# Altium schematic sheet EXTERNAL-INTERFACES.SchDoc: External Interfaces
size A3; Author: João Guimarães; Revision: 1.0.0; SheetNumber: 7; SheetTotal: 7; Project: Automotive Network EVB; PCB: MainBoard; Version: 1.0.0
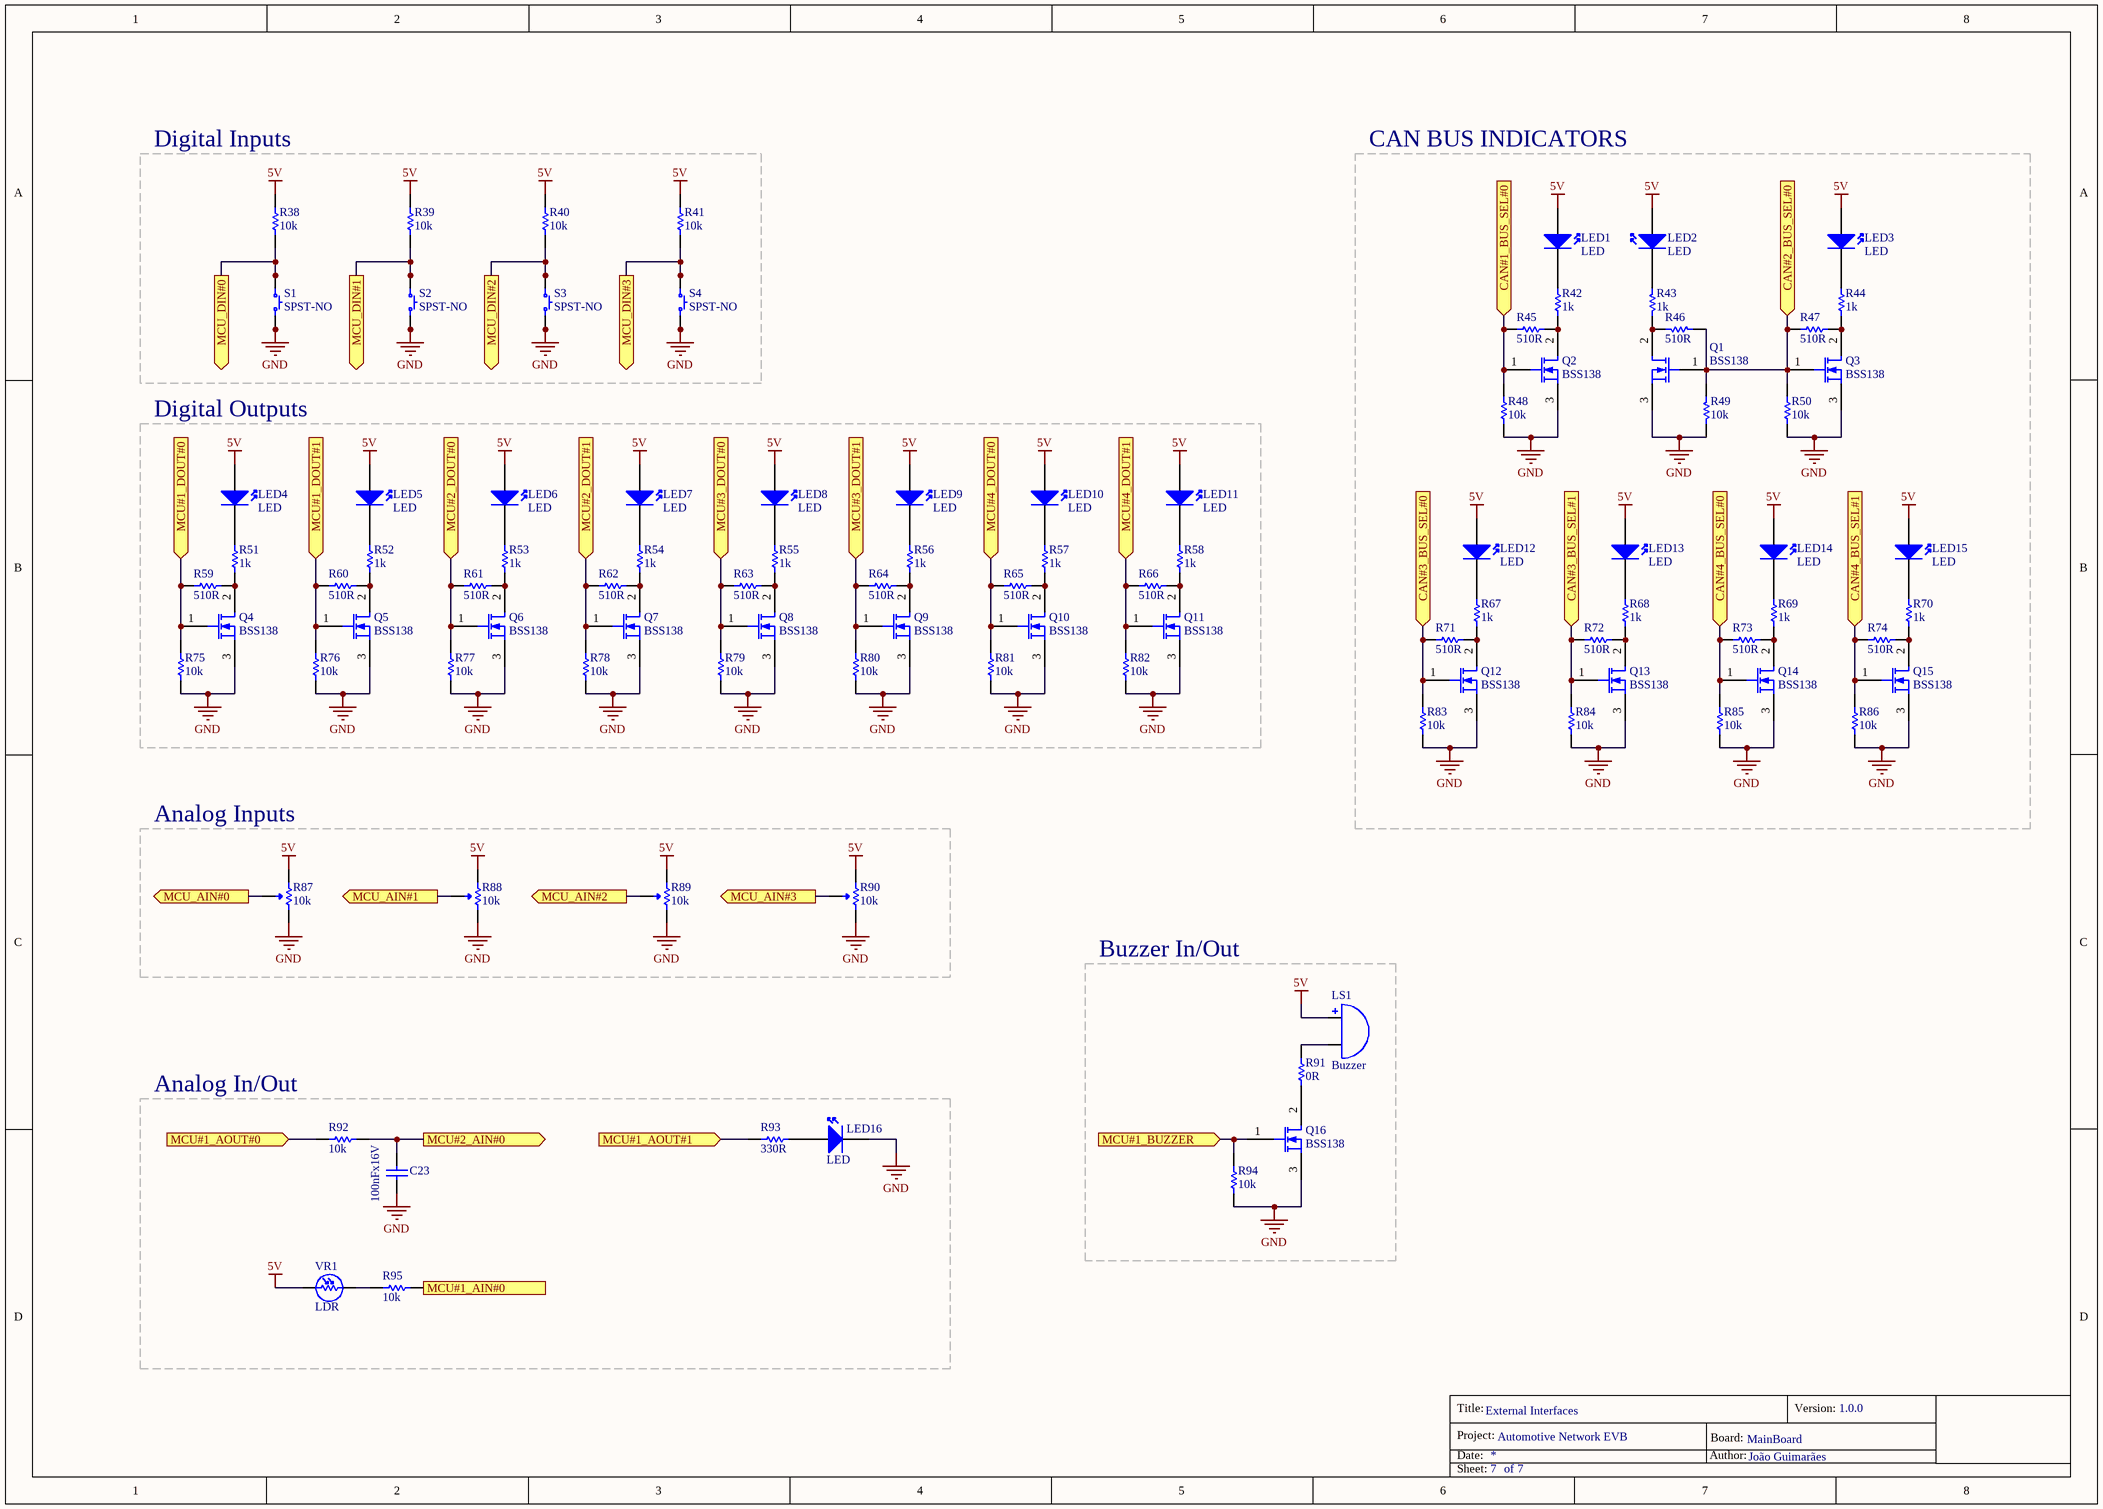
[diagram p0: EXTERNAL-INTERFACES.SchDoc]

## Parts
C23  100nFx16V  [DISC-0603]
LED1  LED  [DISC-LED-1206]
LED2  LED  [DISC-LED-1206]
LED3  LED  [DISC-LED-1206]
LED4  LED  [DISC-LED-0.1-PTH]
LED5  LED  [DISC-LED-0.1-PTH]
LED6  LED  [DISC-LED-0.1-PTH]
LED7  LED  [DISC-LED-0.1-PTH]
LED8  LED  [DISC-LED-0.1-PTH]
LED9  LED  [DISC-LED-0.1-PTH]
LED10  LED  [DISC-LED-0.1-PTH]
LED11  LED  [DISC-LED-0.1-PTH]
LED12  LED  [DISC-LED-1206]
LED13  LED  [DISC-LED-1206]
LED14  LED  [DISC-LED-1206]
LED15  LED  [DISC-LED-1206]
LED16  LED  [DISC-LED-0.1-PTH]
LS1  Buzzer  [DISC-BUZZER-0.3-PTH]
Q1  BSS138  [DISC-SOT-23]
Q2  BSS138  [DISC-SOT-23]
Q3  BSS138  [DISC-SOT-23]
Q4  BSS138  [DISC-SOT-23]
Q5  BSS138  [DISC-SOT-23]
Q6  BSS138  [DISC-SOT-23]
Q7  BSS138  [DISC-SOT-23]
Q8  BSS138  [DISC-SOT-23]
Q9  BSS138  [DISC-SOT-23]
Q10  BSS138  [DISC-SOT-23]
Q11  BSS138  [DISC-SOT-23]
Q12  BSS138  [DISC-SOT-23]
Q13  BSS138  [DISC-SOT-23]
Q14  BSS138  [DISC-SOT-23]
Q15  BSS138  [DISC-SOT-23]
Q16  BSS138  [DISC-SOT-23]
R38  10k  [DISC-0603]
R39  10k  [DISC-0603]
R40  10k  [DISC-0603]
R41  10k  [DISC-0603]
R42  1k  [DISC-0603]
R43  1k  [DISC-0603]
R44  1k  [DISC-0603]
R45  510R  [DISC-0603]
R46  510R  [DISC-0603]
R47  510R  [DISC-0603]
R48  10k  [DISC-0603]
R49  10k  [DISC-0603]
R50  10k  [DISC-0603]
R51  1k  [DISC-0603]
R52  1k  [DISC-0603]
R53  1k  [DISC-0603]
R54  1k  [DISC-0603]
R55  1k  [DISC-0603]
R56  1k  [DISC-0603]
R57  1k  [DISC-0603]
R58  1k  [DISC-0603]
R59  510R  [DISC-0603]
R60  510R  [DISC-0603]
R61  510R  [DISC-0603]
R62  510R  [DISC-0603]
R63  510R  [DISC-0603]
R64  510R  [DISC-0603]
R65  510R  [DISC-0603]
R66  510R  [DISC-0603]
R67  1k  [DISC-0603]
R68  1k  [DISC-0603]
R69  1k  [DISC-0603]
R70  1k  [DISC-0603]
R71  510R  [DISC-0603]
R72  510R  [DISC-0603]
R73  510R  [DISC-0603]
R74  510R  [DISC-0603]
R75  10k  [DISC-0603]
R76  10k  [DISC-0603]
R77  10k  [DISC-0603]
R78  10k  [DISC-0603]
R79  10k  [DISC-0603]
R80  10k  [DISC-0603]
R81  10k  [DISC-0603]
R82  10k  [DISC-0603]
R83  10k  [DISC-0603]
R84  10k  [DISC-0603]
R85  10k  [DISC-0603]
R86  10k  [DISC-0603]
R87  10k  [DISC-TRIMPOT-TSR-3386]
R88  10k  [DISC-TRIMPOT-TSR-3386]
R89  10k  [DISC-TRIMPOT-TSR-3386]
R90  10k  [DISC-TRIMPOT-TSR-3386]
R91  0R  [DISC-0603]
R92  10k  [DISC-0603]
R93  330R  [DISC-0603]
R94  10k  [DISC-0603]
R95  10k  [DISC-0603]
S1  SPST-NO  [DISC-PUSHBUTTON-4P-PTH]
S2  SPST-NO  [DISC-PUSHBUTTON-4P-PTH]
S3  SPST-NO  [DISC-PUSHBUTTON-4P-PTH]
S4  SPST-NO  [DISC-PUSHBUTTON-4P-PTH]
VR1  LDR  [DISC-LDR]

## Blocks framed on the sheet
Digital Inputs: R38-R41 S1-S4
CAN BUS INDICATORS: LED1-LED3 LED12-LED15 Q1-Q3 Q12-Q15 R42-R50 R67-R74 R83-R86
Digital Outputs: LED4-LED11 Q4-Q11 R51-R66 R75-R82
Analog Inputs: R87-R90
Buzzer In/Out: LS1 Q16 R91 R94
Analog In/Out: C23 LED16 R92 R93 R95 VR1

## Ports
CAN#1_BUS_SEL#0 (in), CAN#2_BUS_SEL#0 (in), CAN#3_BUS_SEL#0 (in), CAN#3_BUS_SEL#1 (in), CAN#4_BUS_SEL#0 (in), CAN#4_BUS_SEL#1 (in), MCU#1_AIN#0 (out), MCU#1_AOUT#0 (in), MCU#1_AOUT#1 (in), MCU#1_BUZZER (in), MCU#1_DOUT#0 (in), MCU#1_DOUT#1 (in), MCU#2_AIN#0 (out), MCU#2_DOUT#0 (in), MCU#2_DOUT#1 (in), MCU#3_DOUT#0 (in), MCU#3_DOUT#1 (in), MCU#4_DOUT#0 (in), MCU#4_DOUT#1 (in), MCU_AIN#0 (out), MCU_AIN#1 (out), MCU_AIN#2 (out), MCU_AIN#3 (out), MCU_DIN#0 (out), MCU_DIN#1 (out), MCU_DIN#2 (out), MCU_DIN#3 (out)

## Nets
5V: LED1.1(A) LED2.1(A) LED3.1(A) LED4.1(A) LED5.1(A) LED6.1(A) LED7.1(A) LED8.1(A) LED9.1(A) LED10.1(A) LED11.1(A) LED12.1(A) LED13.1(A) LED14.1(A) LED15.1(A) LS1.1 R38.2 R39.2 R40.2 R41.2 R87.3 R88.3 R89.3 R90.3 VR1.1
GND: C23.2 LED16.2(K) Q1.3(S) Q2.3(S) Q3.3(S) Q4.3(S) Q5.3(S) Q6.3(S) Q7.3(S) Q8.3(S) Q9.3(S) Q10.3(S) Q11.3(S) Q12.3(S) Q13.3(S) Q14.3(S) Q15.3(S) Q16.3(S) R48.1 R49.1 R50.1 R75.1 R76.1 R77.1 R78.1 R79.1 R80.1 R81.1 R82.1 R83.1 R84.1 R85.1 R86.1 R87.1 R88.1 R89.1 R90.1 R94.1 S1.3 S1.4 S2.3 S2.4 S3.3 S3.4 S4.3 S4.4
CAN#1_BUS_SEL#0: Q2.1(g) R45.2 R48.2 ; port CAN#1_BUS_SEL#0
CAN#2_BUS_SEL#0: Q1.1(g) Q3.1(g) R46.2 R47.2 R49.2 R50.2 ; port CAN#2_BUS_SEL#0
CAN#3_BUS_SEL#0: Q12.1(g) R71.2 R83.2 ; port CAN#3_BUS_SEL#0
CAN#3_BUS_SEL#1: Q13.1(g) R72.2 R84.2 ; port CAN#3_BUS_SEL#1
CAN#4_BUS_SEL#0: Q14.1(g) R73.2 R85.2 ; port CAN#4_BUS_SEL#0
CAN#4_BUS_SEL#1: Q15.1(g) R74.2 R86.2 ; port CAN#4_BUS_SEL#1
MCU#1_AIN#0: R95.2 ; port MCU#1_AIN#0
MCU#1_AOUT#0: R92.1 ; port MCU#1_AOUT#0
MCU#1_AOUT#1: R93.2 ; port MCU#1_AOUT#1
MCU#1_BUZZER: Q16.1(g) R94.2 ; port MCU#1_BUZZER
MCU#1_DOUT#0: Q4.1(g) R59.2 R75.2 ; port MCU#1_DOUT#0
MCU#1_DOUT#1: Q5.1(g) R60.2 R76.2 ; port MCU#1_DOUT#1
MCU#2_AIN#0: C23.1 R92.2 ; port MCU#2_AIN#0
MCU#2_DOUT#0: Q6.1(g) R61.2 R77.2 ; port MCU#2_DOUT#0
MCU#2_DOUT#1: Q7.1(g) R62.2 R78.2 ; port MCU#2_DOUT#1
MCU#3_DOUT#0: Q8.1(g) R63.2 R79.2 ; port MCU#3_DOUT#0
MCU#3_DOUT#1: Q9.1(g) R64.2 R80.2 ; port MCU#3_DOUT#1
MCU#4_DOUT#0: Q10.1(g) R65.2 R81.2 ; port MCU#4_DOUT#0
MCU#4_DOUT#1: Q11.1(g) R66.2 R82.2 ; port MCU#4_DOUT#1
MCU_AIN#0: R87.2 ; port MCU_AIN#0
MCU_AIN#1: R88.2 ; port MCU_AIN#1
MCU_AIN#2: R89.2 ; port MCU_AIN#2
MCU_AIN#3: R90.2 ; port MCU_AIN#3
MCU_DIN#0: R38.1 S1.1 S1.2 ; port MCU_DIN#0
MCU_DIN#1: R39.1 S2.1 S2.2 ; port MCU_DIN#1
MCU_DIN#2: R40.1 S3.1 S3.2 ; port MCU_DIN#2
MCU_DIN#3: R41.1 S4.1 S4.2 ; port MCU_DIN#3
NetLED1_2: LED1.2(K) R42.2
NetLED2_2: LED2.2(K) R43.2
NetLED3_2: LED3.2(K) R44.2
NetLED4_2: LED4.2(K) R51.2
NetLED5_2: LED5.2(K) R52.2
NetLED6_2: LED6.2(K) R53.2
NetLED7_2: LED7.2(K) R54.2
NetLED8_2: LED8.2(K) R55.2
NetLED9_2: LED9.2(K) R56.2
NetLED10_2: LED10.2(K) R57.2
NetLED11_2: LED11.2(K) R58.2
NetLED12_2: LED12.2(K) R67.2
NetLED13_2: LED13.2(K) R68.2
NetLED14_2: LED14.2(K) R69.2
NetLED15_2: LED15.2(K) R70.2
NetLED16_1: LED16.1(A) R93.1
NetLS1_2: LS1.2 R91.2
NetQ1_2: Q1.2(D) R43.1 R46.1
NetQ2_2: Q2.2(D) R42.1 R45.1
NetQ3_2: Q3.2(D) R44.1 R47.1
NetQ4_2: Q4.2(D) R51.1 R59.1
NetQ5_2: Q5.2(D) R52.1 R60.1
NetQ6_2: Q6.2(D) R53.1 R61.1
NetQ7_2: Q7.2(D) R54.1 R62.1
NetQ8_2: Q8.2(D) R55.1 R63.1
NetQ9_2: Q9.2(D) R56.1 R64.1
NetQ10_2: Q10.2(D) R57.1 R65.1
NetQ11_2: Q11.2(D) R58.1 R66.1
NetQ12_2: Q12.2(D) R67.1 R71.1
NetQ13_2: Q13.2(D) R68.1 R72.1
NetQ14_2: Q14.2(D) R69.1 R73.1
NetQ15_2: Q15.2(D) R70.1 R74.1
NetQ16_2: Q16.2(D) R91.1
NetR95_1: R95.1 VR1.2

## Notes on the sheet
- Title:
- Project:
- Date:
- Author:
- Board:
- Version:
- Sheet:
- of

## Library data of the parts
C23 = Cap: Capacitor; PartNumber1: C0603C104Z3VACTU; Manufacturer1: Kemet; ClassName: Mcu
LED1 LED2 LED12 LED14 = LED: PartNumber1: BR1101W-TR; Manufacturer1: Stanley; ClassName: ExternalInterfaces
LED3 LED13 LED15 = LED: PartNumber1: AY1101W-TR; Manufacturer1: Stanley; ClassName: ExternalInterfaces
Q1-Q16 = Transistor-NMOS(GDS): Transistor NMOS; PartNumber1: BSS138-13-F; Manufacturer1: Diodes; ClassName: ExternalInterfaces
R38-R41 R48-R50 R75-R86 R94 = Res: PartNumber1: RC0603FR-0710KL; Manufacturer1: Yageo; ClassName: ExternalInterfaces
R42-R44 R51-R58 R68-R70 = Res: PartNumber1: RC0603FR-071KL; Manufacturer1: Yageo; ClassName: ExternalInterfaces
R45-R47 R59-R67 R71-R74 R91 = Res: PartNumber1: RC0603JR-070RL; Manufacturer1: Yageo; ClassName: ExternalInterfaces
R87-R90 = VariableResistor: COM-09806; Manufacturer1: SparkFun; ClassName: ExternalInterfaces; PartNumber1: COM-09806
R92 R95 = Res: Resistor; PartNumber1: RC0603FR-0710KL; Manufacturer1: Yageo; ClassName: ExternalInterfaces
R93 = Res: PartNumber1: RC0603FR-07330RL; Manufacturer1: Yageo; ClassName: ExternalInterfaces
VR1 = LDR: Resistor; ClassName: ExternalInterfaces; Manufacturer1: *; PartNumber1: *
LED4-LED11 LED16 = LED: ClassName: ExternalInterfaces
S1-S4 = SPST-NO: ClassName: *; PartNumber1: *; Manufacturer1: *